# EAGLE design osu-kb (EAGLE 9.6.2)
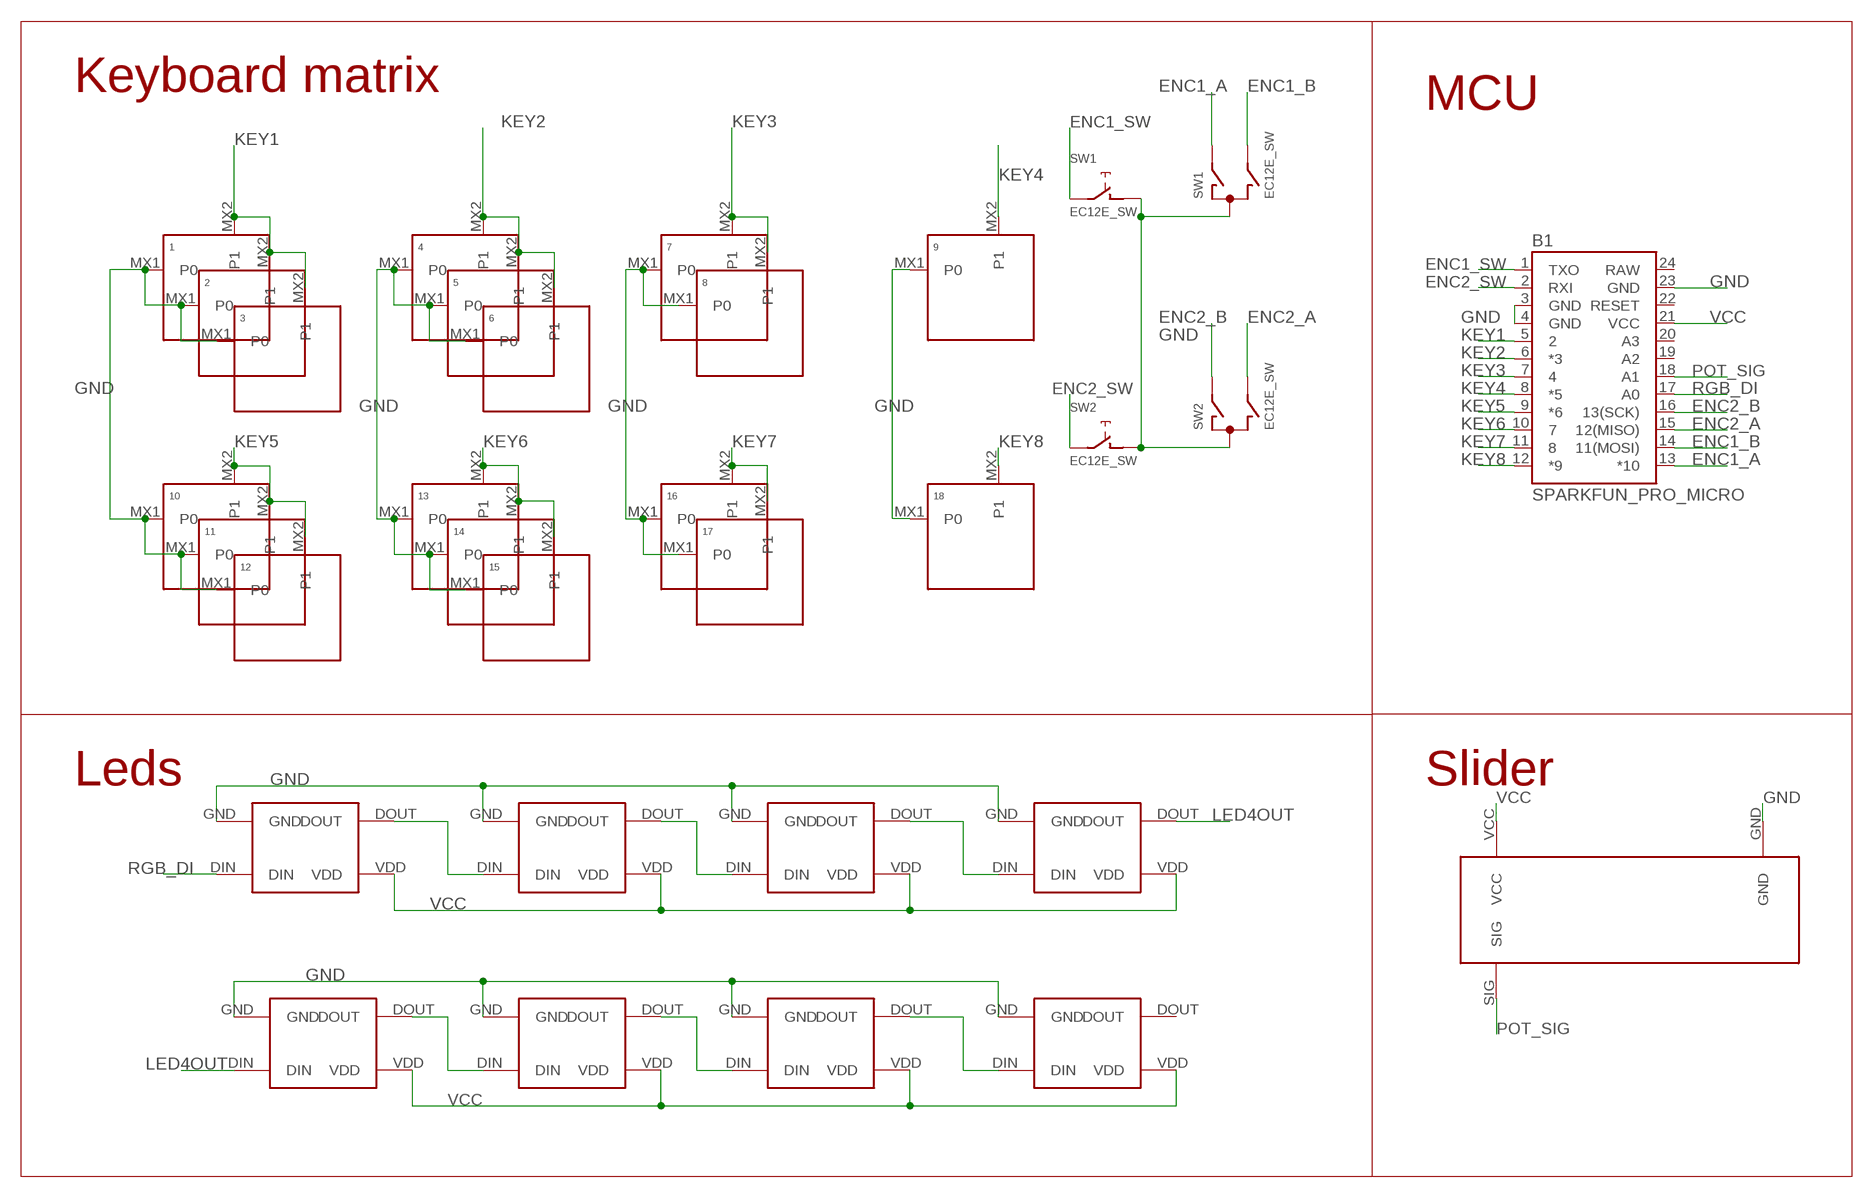
[diagram p0: schematic, sheet 1]

## Parts
1  KEYSWITCH-PLAIN-MX-1U  [MX-1U]
2  KEYSWITCH-PLAIN-MX-1U  [MX-1U]
3  KEYSWITCH-PLAIN-MX-1U  [MX-1U]
4  KEYSWITCH-PLAIN-MX-1U  [MX-1U]
5  KEYSWITCH-PLAIN-MX-1U  [MX-1U]
6  KEYSWITCH-PLAIN-MX-1U  [MX-1U]
7  KEYSWITCH-PLAIN-MX-1U  [MX-1U]
8  KEYSWITCH-PLAIN-MX-1U  [MX-1U]
9  KEYSWITCH-PLAIN-MX-1U  [MX-1U]
10  KEYSWITCH-PLAIN-MX-1U  [MX-1U]
11  KEYSWITCH-PLAIN-MX-1U  [MX-1U]
12  KEYSWITCH-PLAIN-MX-1U  [MX-1U]
13  KEYSWITCH-PLAIN-MX-1U  [MX-1U]
14  KEYSWITCH-PLAIN-MX-1U  [MX-1U]
15  KEYSWITCH-PLAIN-MX-1U  [MX-1U]
16  KEYSWITCH-PLAIN-MX-1U  [MX-1U]
17  KEYSWITCH-PLAIN-MX-1U  [MX-1U]
18  KEYSWITCH-PLAIN-MX-1U  [MX-1U]
B1  SPARKFUN_PRO_MICRO  [SPARKFUN_PRO_MICRO]
SW1  EC12E_SW  [ALPS_EC12E_SW]
SW2  EC12E_SW  [ALPS_EC12E_SW]
U$1  SK6812MINI-E  [SK6812MINI-E]
U$2  SK6812MINI-E  [SK6812MINI-E]
U$3  SK6812MINI-E  [SK6812MINI-E]
U$4  SK6812MINI-E  [SK6812MINI-E]
U$5  SK6812MINI-E  [SK6812MINI-E]
U$6  SK6812MINI-E  [SK6812MINI-E]
U$7  SK6812MINI-E  [SK6812MINI-E]
U$8  SK6812MINI-E  [SK6812MINI-E]
U$9  SH_SL60V_B10K  [SH_SL60V_B10K]

## Nets
ENC1_A: B1.13(*10) SW1.A
ENC1_B: B1.14(11(MOSI)) SW1.B
ENC1_SW: B1.1(TXO) SW1.E
ENC2_A: B1.15(12(MISO)) SW2.B
ENC2_B: B1.16(13(SCK)) SW2.A
ENC2_SW: B1.2(RXI) SW2.E
GND: 1.MX1(P0) 2.MX1(P0) 3.MX1(P0) 4.MX1(P0) 5.MX1(P0) 6.MX1(P0) 7.MX1(P0) 8.MX1(P0) 9.MX1(P0) 10.MX1(P0) 11.MX1(P0) 12.MX1(P0) 13.MX1(P0) 14.MX1(P0) 15.MX1(P0) 16.MX1(P0) 17.MX1(P0) 18.MX1(P0) B1.3(GND) B1.4(GND) B1.23(GND) SW1.C SW1.D SW2.C SW2.D U$1.GND U$2.GND U$3.GND U$4.GND U$5.GND U$6.GND U$7.GND U$8.GND U$9.GND
KEY1: 1.MX2(P1) 2.MX2(P1) 3.MX2(P1) B1.5
KEY2: 4.MX2(P1) 5.MX2(P1) 6.MX2(P1) B1.6(*3)
KEY3: 7.MX2(P1) 8.MX2(P1) B1.7
KEY4: 9.MX2(P1) B1.8(*5)
KEY5: 10.MX2(P1) 11.MX2(P1) 12.MX2(P1) B1.9(*6)
KEY6: 13.MX2(P1) 14.MX2(P1) 15.MX2(P1) B1.10
KEY7: 16.MX2(P1) 17.MX2(P1) B1.11
KEY8: 18.MX2(P1) B1.12(*9)
LED4OUT: U$4.DOUT U$5.DIN
N$1: U$1.DOUT U$2.DIN
N$2: U$2.DOUT U$3.DIN
N$3: U$3.DOUT U$4.DIN
N$6: U$5.DOUT U$6.DIN
N$7: U$6.DOUT U$7.DIN
N$8: U$7.DOUT U$8.DIN
POT_SIG: B1.18(A1) U$9.SIG
RGB_DI: B1.17(A0) U$1.DIN
VCC: B1.21(VCC) U$1.VDD U$2.VDD U$3.VDD U$4.VDD U$5.VDD U$6.VDD U$7.VDD U$8.VDD U$9.VCC
Unconnected: B1.19(A2) B1.20(A3) B1.22(RESET) SW1.GND1(G) SW1.GND2(G) SW2.GND1(G) SW2.GND2(G) U$8.DOUT

## Notes on the sheet
- Keyboard matrix
- MCU
- Leds | Slider

## Power pins joined to a net without a drawn wire
RAW: B1.24(RAW)

## Library data of the parts
1-18 = Keyboard:KEYSWITCH-PLAIN
B1 = SparkFun-Boards:SPARKFUN_PRO_MICRO: SparkFun Pro Micro Atmega32U4 compatible footprint. SparkFun Products: 3.3V/8MHz <https://www.sparkfun.com/products/12587> 5V/16MHz <https://www.sparkfun.com/products/12640>
SW1 SW2 = switch-alps:EC12E_SW: ALPS rotary Encoder EC12E series with switch; MPN: EC12E2424407; OC_FARNELL: 1520813; OC_NEWARK: 74M1068
U$1-U$8 = sk6812mini-e:SK6812MINI-E
U$9 = SH_SL60V_B10K:SH_SL60V_B10K

## Board
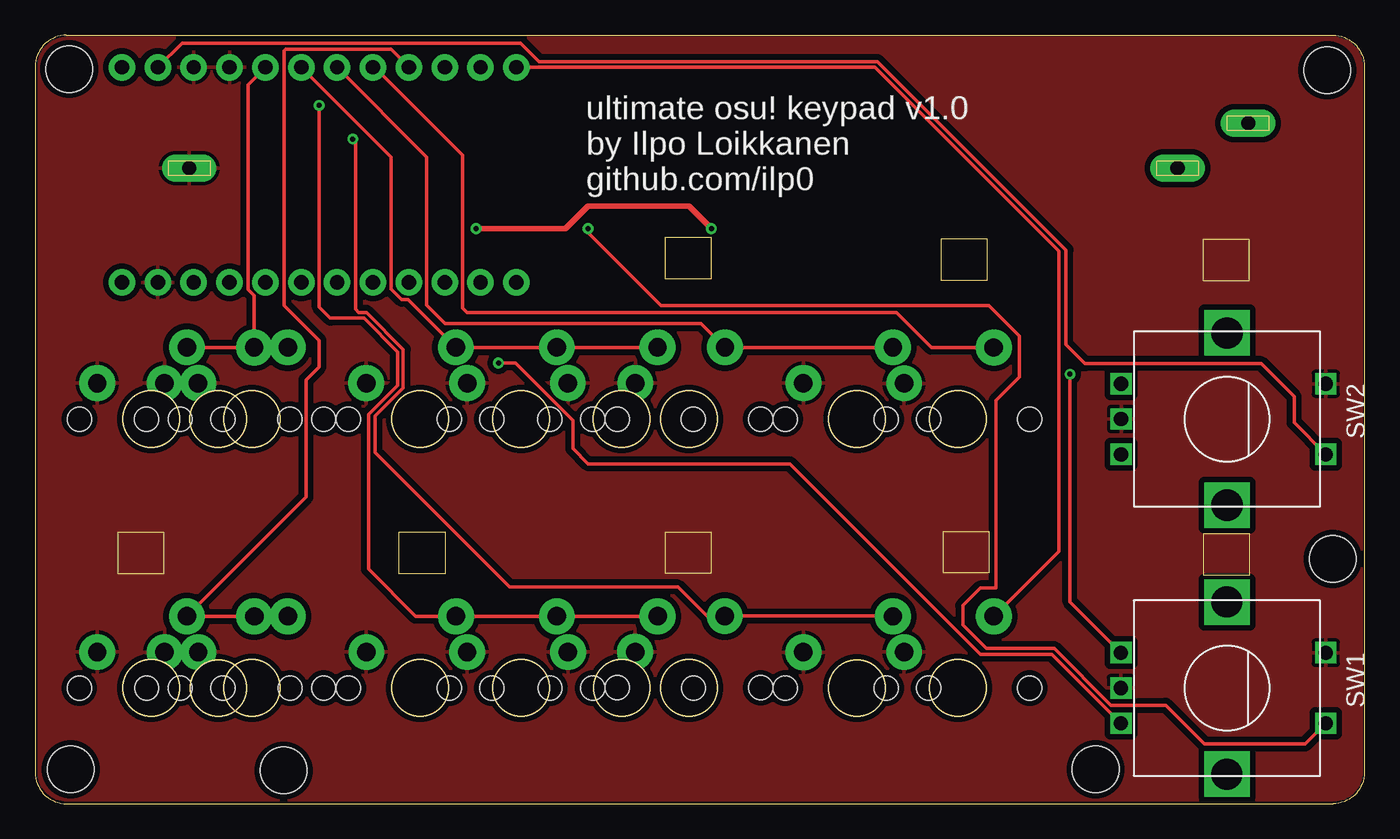
[diagram p1: board, top side]
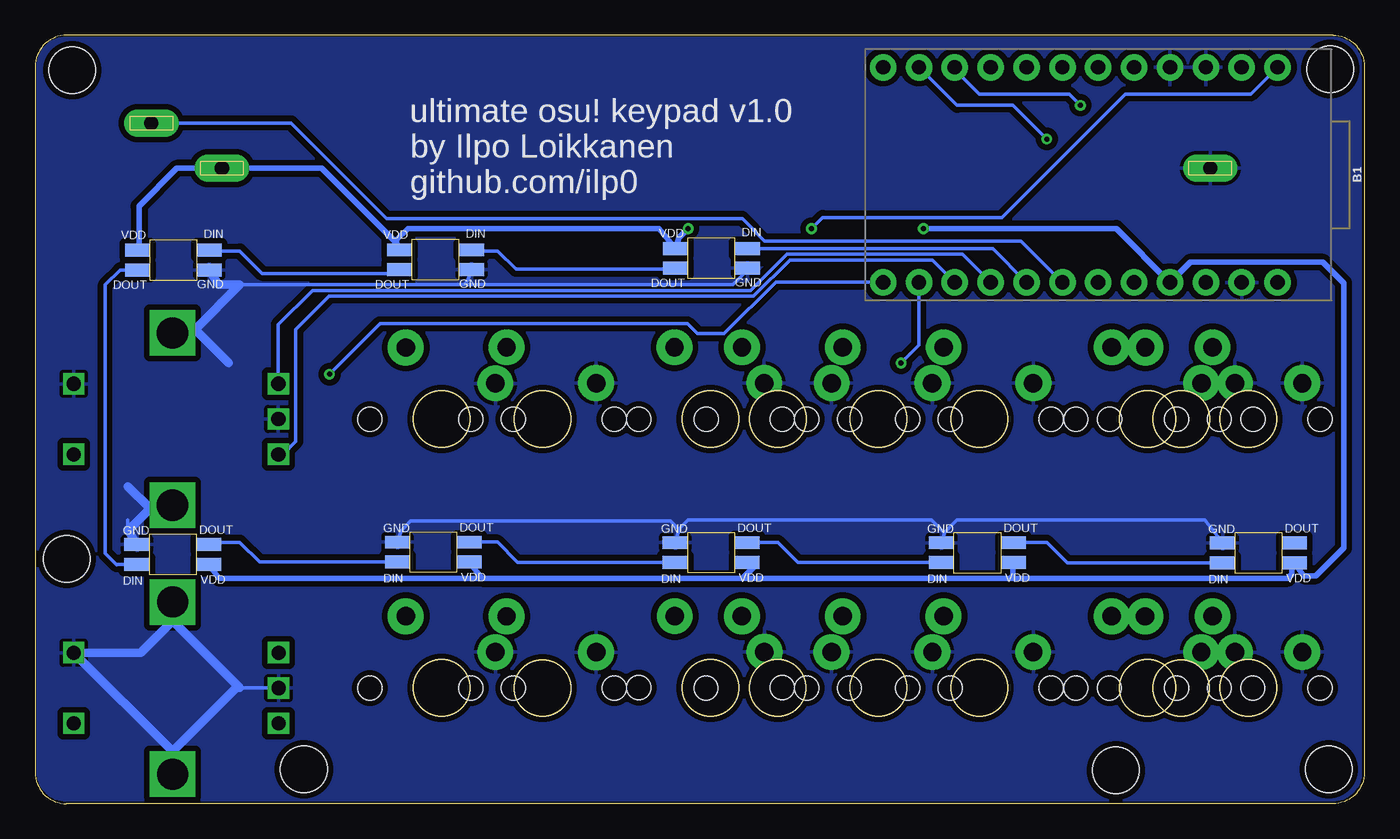
[diagram p2: board, bottom side, seen from below]

Size 94.12 x 54.44 mm. Coordinates in mm from the lower left corner, seen from the top.
Outline: 2.2,54.44 91.92,54.44 arc-90 94.12,52.24 94.12,2.2 arc-90 91.92,0 2.2,0 arc-90 0,2.2 0,52.24 arc-90 2.2,54.44
Outline: circle at 8.2,8.2 radius 2
Outline: circle at 12.96,8.2 radius 2
Outline: circle at 15.34,8.2 radius 2
Outline: circle at 27.25,8.2 radius 2
Outline: circle at 34.39,8.2 radius 2
Outline: circle at 41.54,8.2 radius 2
Outline: circle at 46.3,8.2 radius 2
Outline: circle at 58.21,8.2 radius 2
Outline: circle at 65.35,8.2 radius 2
Outline: circle at 8.2,27.25 radius 2
Outline: circle at 27.25,27.25 radius 2
Outline: circle at 46.3,27.25 radius 2
Outline: circle at 65.35,27.25 radius 2
Outline: circle at 12.96,27.25 radius 2
Outline: circle at 15.34,27.25 radius 2
Outline: circle at 34.39,27.25 radius 2
Outline: circle at 41.54,27.25 radius 2
Outline: circle at 58.21,27.25 radius 2
Copper layers (1*16): Top 0.035mm / dielectric 1.5mm / Bottom 0.035mm
Design rules "default *": minimum track width 10mil, minimum drill 0.35mm, track to track 6mil, track to pad 6mil, pad to pad 6mil, via to via 6mil, smd to smd 0mil, copper to edge 0mil, drill to drill 6mil, minimum pad ring 10mil, minimum via ring 8mil, stop-mask expansion 4mil, vias tented up to drill 0mil, thermal gap 10mil
Holes 3.3 mm at 2.5,2.45 17.6,2.35 75.1,2.45 91.5,51.95 2.4,52.05 91.9,17.35

### Footprints (pad centres in the part's own frame; a part is rotated, then mirrored left to right if it is on the bottom)
MX-1U = drill 1.3 pad 2.54: MX1 -3.81,2.54; MX2 2.54,5.08 | hole 4: 0,0 | hole 1.7: -5.08,0; 5.08,0
SPARKFUN_PRO_MICRO = drill 1.016 pad 1.88: 1 -7.62,12.7; 2 -7.62,10.16; 3 -7.62,7.62; 4 -7.62,5.08; 5 -7.62,2.54; 6 -7.62,0; 7 -7.62,-2.54; 8 -7.62,-5.08; 9 -7.62,-7.62; 10 -7.62,-10.16; 11 -7.62,-12.7; 12 -7.62,-15.24; 13 7.62,-15.24; 14 7.62,-12.7; 15 7.62,-10.16; 16 7.62,-7.62; 17 7.62,-5.08; 18 7.62,-2.54; 19 7.62,0; 20 7.62,2.54; 21 7.62,5.08; 22 7.62,7.62; 23 7.62,10.16; 24 7.62,12.7
ALPS_EC12E_SW = drill 1 square: A -2.5,-7.5; B 2.5,-7.5; C 0,-7.5; D -2.5,7; E 2.5,7 | drill 2.2 square: GND1 -6.1,0; GND2 6.1,0
SK6812MINI-E = smd 1.778 x 0.914 bottom: DIN 4.191,0.762; DOUT -0.889,2.159; GND 4.191,2.159; VDD -0.889,0.762
SH_SL60V_B10K = drill 1 pad 1.93 long: GND 70,0; SIG -5,-3.2; VCC 0,0

### Placement (x,y rotation side)
1  8.2,27.25 0 top
2  12.96,27.24 0 top
3  15.34,27.25 0 top
4  27.25,27.25 0 top
5  34.4,27.25 0 top
6  41.53,27.25 0 top
7  46.31,27.25 0 top
8  58.21,27.25 0 top
9  65.35,27.24 0 top
10  8.2,8.2 0 top
11  12.97,8.19 0 top
12  15.34,8.2 0 top
13  27.26,8.2 0 top
14  34.4,8.2 0 top
15  41.54,8.2 0 top
16  46.29,8.21 0 top
17  58.21,8.19 0 top
18  65.35,8.2 0 top
B1  18.84,44.55 270 bottom
SW1  84.4,8.19 270 top
SW2  84.41,27.25 270 top
U$1  47.89,40.1 180 top
U$2  67.43,40 180 top
U$3  85.99,39.97 180 top
U$4  82.73,16.2 0 top
U$5  64.28,16.37 0 top
U$6  44.6,16.33 0 top
U$7  25.75,16.33 0 top
U$8  5.84,16.3 0 top
U$9  80.91,45.02 180 top

### Tracks (layer width: path | path; a pad name or v marks a point on that pad's centre or on a via)
ENC1_A  (via drill 0.35)
  Top 0.254: SW1.A 73.29,14.3 v73.29,30.43
  Bottom 0.254: B1.13 34.11,36.97 41.65,36.97 45.33,33.29 47.23,33.29 47.94,34 69.71,34 v73.29,30.43
ENC1_B  (via drill 0.35)
  Top 0.254: SW1.B 72.01,10.58 66.94,10.58 53.44,24.07 39.16,24.07 38.08,25.15 38.08,27.16 34.02,31.22 v32.81,31.22
  Bottom 0.254: v32.81,31.22 31.54,32.49 B1.14
ENC1_SW  (via drill 0.35)
  Top 0.254: v39.16,40.74 39.16,40.44 44.32,35.28 67.54,35.28 69.69,33.13 69.69,30.22 68.05,28.58 68.05,15.27 66.94,15.27 65.7,14.03 65.7,12.66 67.37,10.99 72.18,10.99 76.19,6.98 80.06,6.98 82.81,4.23 89.94,4.23 SW1.E
  Bottom 0.254: B1.1 8.04,50.27 16.93,50.27 25.66,41.54 38.36,41.54 v39.16,40.74
ENC2_A
  Bottom 0.254: B1.15 30.58,38.52 40.68,38.52 43.24,35.96 73.31,35.96 75.67,33.6 75.67,25.66 76.58,24.75 SW2.B
ENC2_B
  Bottom 0.254: B1.16 28.45,38.93 40.9,38.93 43.46,36.37 74.49,36.37 76.91,33.95 SW2.A
ENC2_SW
  Top 0.254: SW2.E 89.16,27 89.16,28.84 86.83,31.17 74.35,31.17 73,32.52 73,39.22 59.64,52.58 35.67,52.58 34.36,53.89 10.39,53.89 B1.2
GND
  Bottom 0.254: U$8.GND 11.29,20.11 28.84,20.11 29.69,19.26 | U$7.GND 29.69,19.26 | 29.69,19.26 29.81,19.26 30.66,20.11 47.89,20.11 48.54,19.45 | U$6.GND 48.54,19.45 | 48.54,19.45 48.58,19.45 49.15,20.02 67.53,20.02 68.22,19.33 U$5.GND | 63.76,36.77 79.64,36.77 | 63.76,36.77 63.49,37.05 U$2.GND | 63.76,36.77 44.71,36.77 43.95,37.54 U$1.GND | U$4.GND 87.49,19.31 87.58,19.31 | 84.4,3.7 84.4,3.44 | SW1.C 79.64,8.19 79.9,8.19 | 87.58,20.11 87.58,19.39
  Bottom 0.61: 79.9,8.19 84.4,3.7 SW1.D 86.67,10.69 84.4,12.96 79.64,8.2 79.64,8.19 | U$4.GND 87.58,19.39 87.49,19.39 85.99,20.9 87.58,22.49 | U$3.GND 81.14,36.77 79.64,36.77 82.81,33.6 80.43,31.22
  pour Top (isolate 0.4): 93.92,52.24 93.92,2.26 arc-90 91.92,0.26 2.26,0.26 arc-90 0.26,2.26 0.26,52.24 arc-90 2.26,54.24 91.92,54.24 arc-90
  pour Bottom (isolate 0.406): 2.26,54.24 91.92,54.24 arc-90 93.92,52.24 93.92,2.26 arc-90 91.92,0.26 2.26,0.26 arc-90 0.26,2.26 0.26,52.24 arc-90
KEY1
  Top 0.254: 2.MX2 15.5,36.01 15.08,36.43 15.08,50.95 B1.5 | 2.MX2 3.MX2 | 2.MX2 1.MX2
KEY2
  Top 0.254: 6.MX2 5.MX2 4.MX2 26.4,35.72 25.95,35.72 25.21,36.46 25.21,45.8 B1.6
KEY3
  Top 0.254: B1.7 27.73,45.82 27.73,35.31 29.01,34.03 47.15,34.03 7.MX2 8.MX2
KEY4
  Top 0.254: 9.MX2 63.45,32.32 61,34.78 30.58,34.78 30.26,35.1 30.26,45.94 24.03,52.17 B1.8
KEY5
  Top 0.254: 12.MX2 11.MX2 10.MX2 19.18,21.72 19.18,30.02 20.1,30.94 20.1,32.81 17.61,35.3 17.61,53.33 17.73,53.44 25.19,53.44 B1.9
KEY6  (via drill 0.35)
  Top 0.254: 15.MX2 14.MX2 13.MX2 26.93,13.28 23.59,16.62 23.59,27.56 25.66,29.63 25.66,32.01 23.28,34.39 20.9,34.39 20.11,35.19 v20.11,49.48
  Bottom 0.254: v20.11,49.48 20.9,50.27 27.25,50.27 29,52.02 B1.10
KEY7  (via drill 0.35)
  Top 0.254: 17.MX2 60.73,13.29 16.MX2 47.56,13.29 45.51,15.34 33.6,15.34 24.07,24.87 24.07,27.47 26.07,29.46 26.07,32.18 23.45,34.8 22.91,34.8 22.68,35.03 22.68,46.9 v22.49,47.09
  Bottom 0.254: v22.49,47.09 24.87,49.48 28.84,49.48 B1.11
KEY8
  Top 0.254: 18.MX2 72.49,17.88 72.49,39.16 59.48,52.17 B1.12
LED4OUT
  Bottom 0.254: U$5.DIN 78.25,17.13 79.64,18.52 81.94,18.52 U$4.DOUT
N$1
  Bottom 0.254: U$2.DIN 63.41,39.16 61.38,39.16 60.08,37.86 48.6,37.86 U$1.DOUT
N$2
  Bottom 0.254: U$3.DIN 82,39.16 79.64,39.16 78.05,37.57 68.33,37.57 U$2.DOUT
N$3
  Bottom 0.254: U$4.DIN 88.34,16.96 88.37,16.93 89.16,17.73 89.16,36.77 88.13,37.81 U$3.DOUT
N$6
  Bottom 0.254: U$6.DIN 59.96,17.09 61.39,18.53 U$5.DOUT
N$7
  Bottom 0.254: U$7.DIN 40.11,17.09 41.54,18.52 43.94,18.52 U$6.DOUT
N$8
  Bottom 0.254: U$8.DIN 21.03,17.06 22.49,18.52 25.09,18.52 U$7.DOUT
POT_SIG
  Bottom 0.254: B1.18 24.31,39.87 42.47,39.87 44.05,41.46 69.24,41.46 76,48.22 U$9.SIG
RGB_DI
  Bottom 0.254: U$1.DIN 26.32,39.33 B1.17
VCC  (via drill 0.35)
  Top 0.406: v47.89,40.74 46.3,42.33 39.16,42.33 37.57,40.74 v31.22,40.74
  Bottom 0.406: 68.53,39.7 68.53,39.95 67.73,40.74 49.93,40.74 U$1.VDD 48.52,40.11 v47.89,40.74 | U$2.VDD 68.53,39.7 | 68.53,39.7 73.84,45.02 U$9.VCC 84.09,45.02 86.78,42.33 86.78,39.36 U$3.VDD | U$5.VDD 62.48,15.96 | 62.48,15.96 44.05,15.96 | 44.05,15.96 43.12,16.88 43.12,16.93 43.29,17.09 U$6.VDD | 44.05,15.96 25.05,15.96 | 25.05,15.96 24.87,16.14 24.87,16.85 U$7.VDD | 25.05,15.96 5.4,15.96 5.12,16.24 5.12,16.98 U$8.VDD 4.27,16.14 3.44,16.14 1.46,18.12 1.46,36.89 2.93,38.36 12.33,38.36 B1.21 17.57,40.74 v31.22,40.74 | 62.48,15.96 81.09,15.96 U$4.VDD

### Text on the board
tPlace: ultimate osu! keypad v1.0 / by Ilpo Loikkanen / github.com/ilp0
bPlace: ultimate osu! keypad v1.0 / by Ilpo Loikkanen / github.com/ilp0